# Altium schematic sheet Sheet1.SchDoc
size A
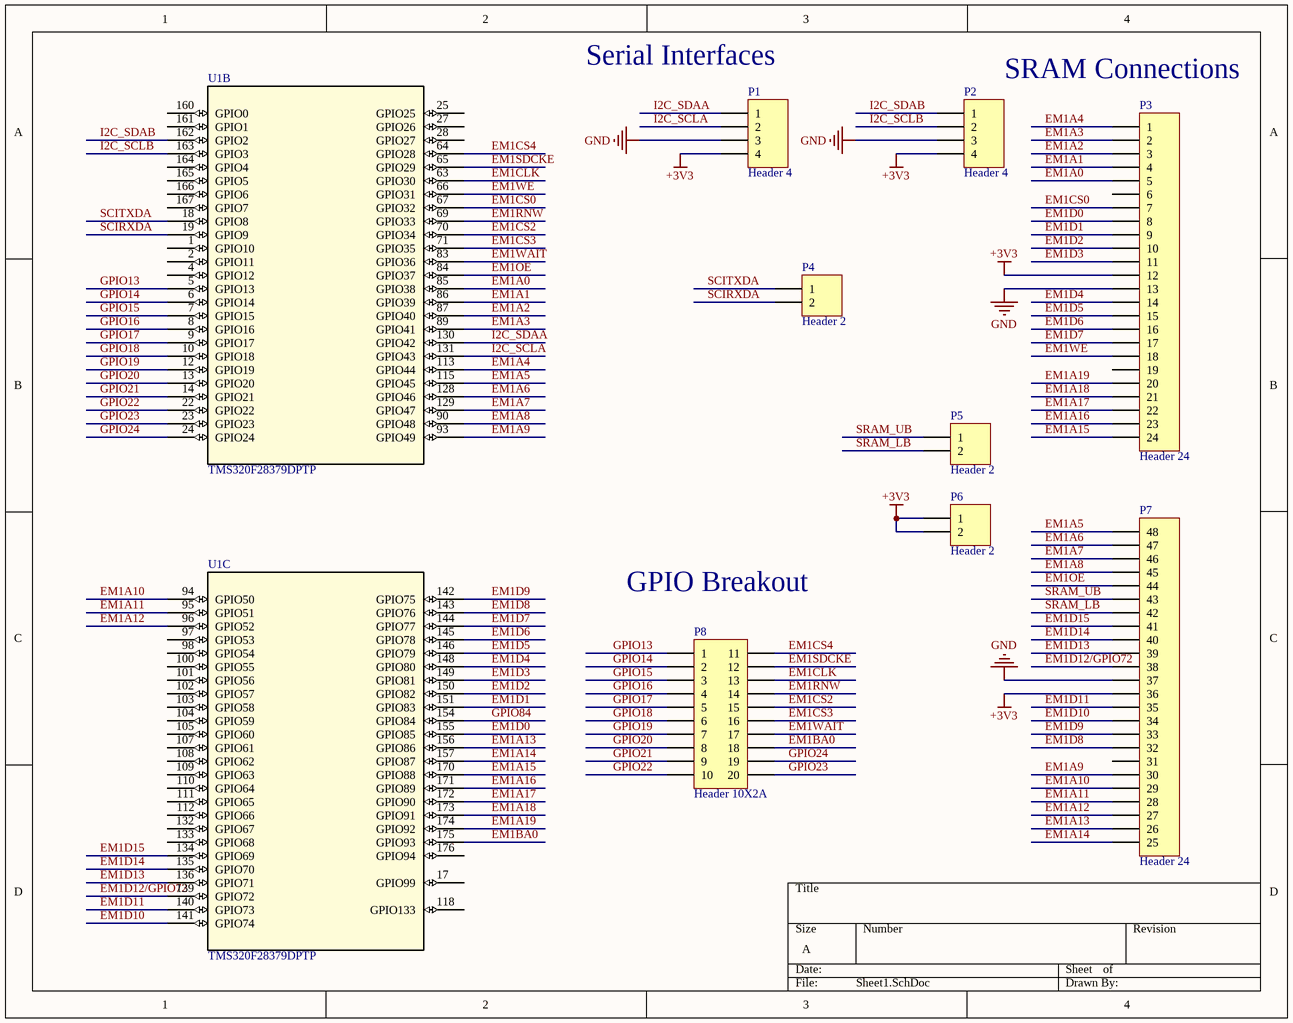
[diagram p0: Sheet1.SchDoc]

## Parts
P1  Header 4  [HDR1X4]
P2  Header 4  [HDR1X4]
P3  Header 24  [HDR1X24]
P4  Header 2  [HDR1X2]
P5  Header 2  [HDR1X2]
P6  Header 2  [HDR1X2]
P7  Header 24  [HDR1X24]
P8  Header 10X2A  [HDR2X10_CEN]
U1  TMS320F28379DPTP  [PTP0176F_L]  (parts B,C of 5)

## Nets
+3V3: P1.4 P2.4 P3.12 P6.1 P6.2 P7.13(36)
GND: P1.3 P2.3 P3.13 P7.12(37)
EM1A0: P3.5 U1.85(GPIO38)
EM1A1: P3.4 U1.86(GPIO39)
EM1A2: P3.3 U1.87(GPIO40)
EM1A3: P3.2 U1.89(GPIO41)
EM1A4: P3.1 U1.113(GPIO44)
EM1A5: P7.1(48) U1.115(GPIO45)
EM1A6: P7.2(47) U1.128(GPIO46)
EM1A7: P7.3(46) U1.129(GPIO47)
EM1A8: P7.4(45) U1.90(GPIO48)
EM1A9: P7.19(30) U1.93(GPIO49)
EM1A10: P7.20(29) U1.94(GPIO50)
EM1A11: P7.21(28) U1.95(GPIO51)
EM1A12: P7.22(27) U1.96(GPIO52)
EM1A13: P7.23(26) U1.156(GPIO86)
EM1A14: P7.24(25) U1.157(GPIO87)
EM1A15: P3.24 U1.170(GPIO88)
EM1A16: P3.23 U1.171(GPIO89)
EM1A17: P3.22 U1.172(GPIO90)
EM1A18: P3.21 U1.173(GPIO91)
EM1A19: P3.20 U1.174(GPIO92)
EM1BA0: P8.18 U1.175(GPIO93)
EM1CLK: P8.13 U1.63(GPIO30)
EM1CS0: P3.7 U1.67(GPIO32)
EM1CS2: P8.15 U1.70(GPIO34)
EM1CS3: P8.16 U1.71(GPIO35)
EM1CS4: P8.11 U1.64(GPIO28)
EM1D0: P3.8 U1.155(GPIO85)
EM1D1: P3.9 U1.151(GPIO83)
EM1D2: P3.10 U1.150(GPIO82)
EM1D3: P3.11 U1.149(GPIO81)
EM1D4: P3.14 U1.148(GPIO80)
EM1D5: P3.15 U1.146(GPIO79)
EM1D6: P3.16 U1.145(GPIO78)
EM1D7: P3.17 U1.144(GPIO77)
EM1D8: P7.17(32) U1.143(GPIO76)
EM1D9: P7.16(33) U1.142(GPIO75)
EM1D10: P7.15(34) U1.141(GPIO74)
EM1D11: P7.14(35) U1.140(GPIO73)
EM1D12/GPIO72: P7.11(38) U1.139(GPIO72)
EM1D13: P7.10(39) U1.136(GPIO71)
EM1D14: P7.9(40) U1.135(GPIO70)
EM1D15: P7.8(41) U1.134(GPIO69)
EM1OE: P7.5(44) U1.84(GPIO37)
EM1RNW: P8.14 U1.69(GPIO33)
EM1SDCKE: P8.12 U1.65(GPIO29)
EM1WAIT: P8.17 U1.83(GPIO36)
EM1WE: P3.18 U1.66(GPIO31)
GPIO13: P8.1 U1.5(GPIO13)
GPIO14: P8.2 U1.6(GPIO14)
GPIO15: P8.3 U1.7(GPIO15)
GPIO16: P8.4 U1.8(GPIO16)
GPIO17: P8.5 U1.9(GPIO17)
GPIO18: P8.6 U1.10(GPIO18)
GPIO19: P8.7 U1.12(GPIO19)
GPIO20: P8.8 U1.13(GPIO20)
GPIO21: P8.9 U1.14(GPIO21)
GPIO22: P8.10 U1.22(GPIO22)
GPIO23: P8.20 U1.23(GPIO23)
GPIO24: P8.19 U1.24(GPIO24)
GPIO84: U1.154(GPIO84)
I2C_SCLA: P1.2 U1.131(GPIO43)
I2C_SCLB: P2.2 U1.163(GPIO3)
I2C_SDAA: P1.1 U1.130(GPIO42)
I2C_SDAB: P2.1 U1.162(GPIO2)
SCIRXDA: P4.2 U1.19(GPIO9)
SCITXDA: P4.1 U1.18(GPIO8)
SRAM_LB: P5.2 P7.7(42)
SRAM_UB: P5.1 P7.6(43)

Not connected (* = marked no-connect by the designer): P3 6 19; P7 18(31); U1 1(GPIO10) 2(GPIO11) 4(GPIO12) 17(GPIO99) 25(GPIO25) 27(GPIO26) 28(GPIO27) 97(GPIO53) 98(GPIO54) 100(GPIO55) 101(GPIO56) 102(GPIO57) 103(GPIO58) 104(GPIO59) 105(GPIO60) 107(GPIO61) 108(GPIO62) 109(GPIO63) 110(GPIO64) 111(GPIO65) 112(GPIO66) 118(GPIO133) 132(GPIO67) 133(GPIO68) 160(GPIO0) 161(GPIO1) 164(GPIO4) 165(GPIO5) 166(GPIO6) 167(GPIO7) 176(GPIO94)

## Notes on the sheet
- (near P1) Serial Interfaces
- SRAM Connections
- GPIO Breakout

## Library data of the parts
P1 P2 = Header 4: Header, 4-Pin; LatestRevisionDate: 17-Jul-2002; LatestRevisionNote: Re-released for DXP Platform.; Publisher: Altium Limited
P3 P7 = Header 24: Header, 24-Pin; LatestRevisionDate: 17-Jul-2002; LatestRevisionNote: Re-released for DXP Platform.; Publisher: Altium Limited
P4-P6 = Header 2: Header, 2-Pin; LatestRevisionDate: 17-Jul-2002; LatestRevisionNote: Re-released for DXP Platform.; Publisher: Altium Limited
P8 = Header 10X2A: Header, 10-Pin, Dual row; LatestRevisionDate: 17-Jul-2002; LatestRevisionNote: Re-released for DXP Platform.; Publisher: Altium Limited
U1 = TMS320F28379DPTP: Imported; PartNumber: TMS320F28379DPTPS; Manufacturer: Texas Instruments; RefDes: RefDes; TYPE: TYPE; Value: Value